# Altium schematic sheet FEU31_Part3.SchDoc: Интерфейсный модуль ФЭУ-31
size A3; Address1: (с) Быканов Андрей; Address2: г.Тула 2016г.; Revision: 1.3
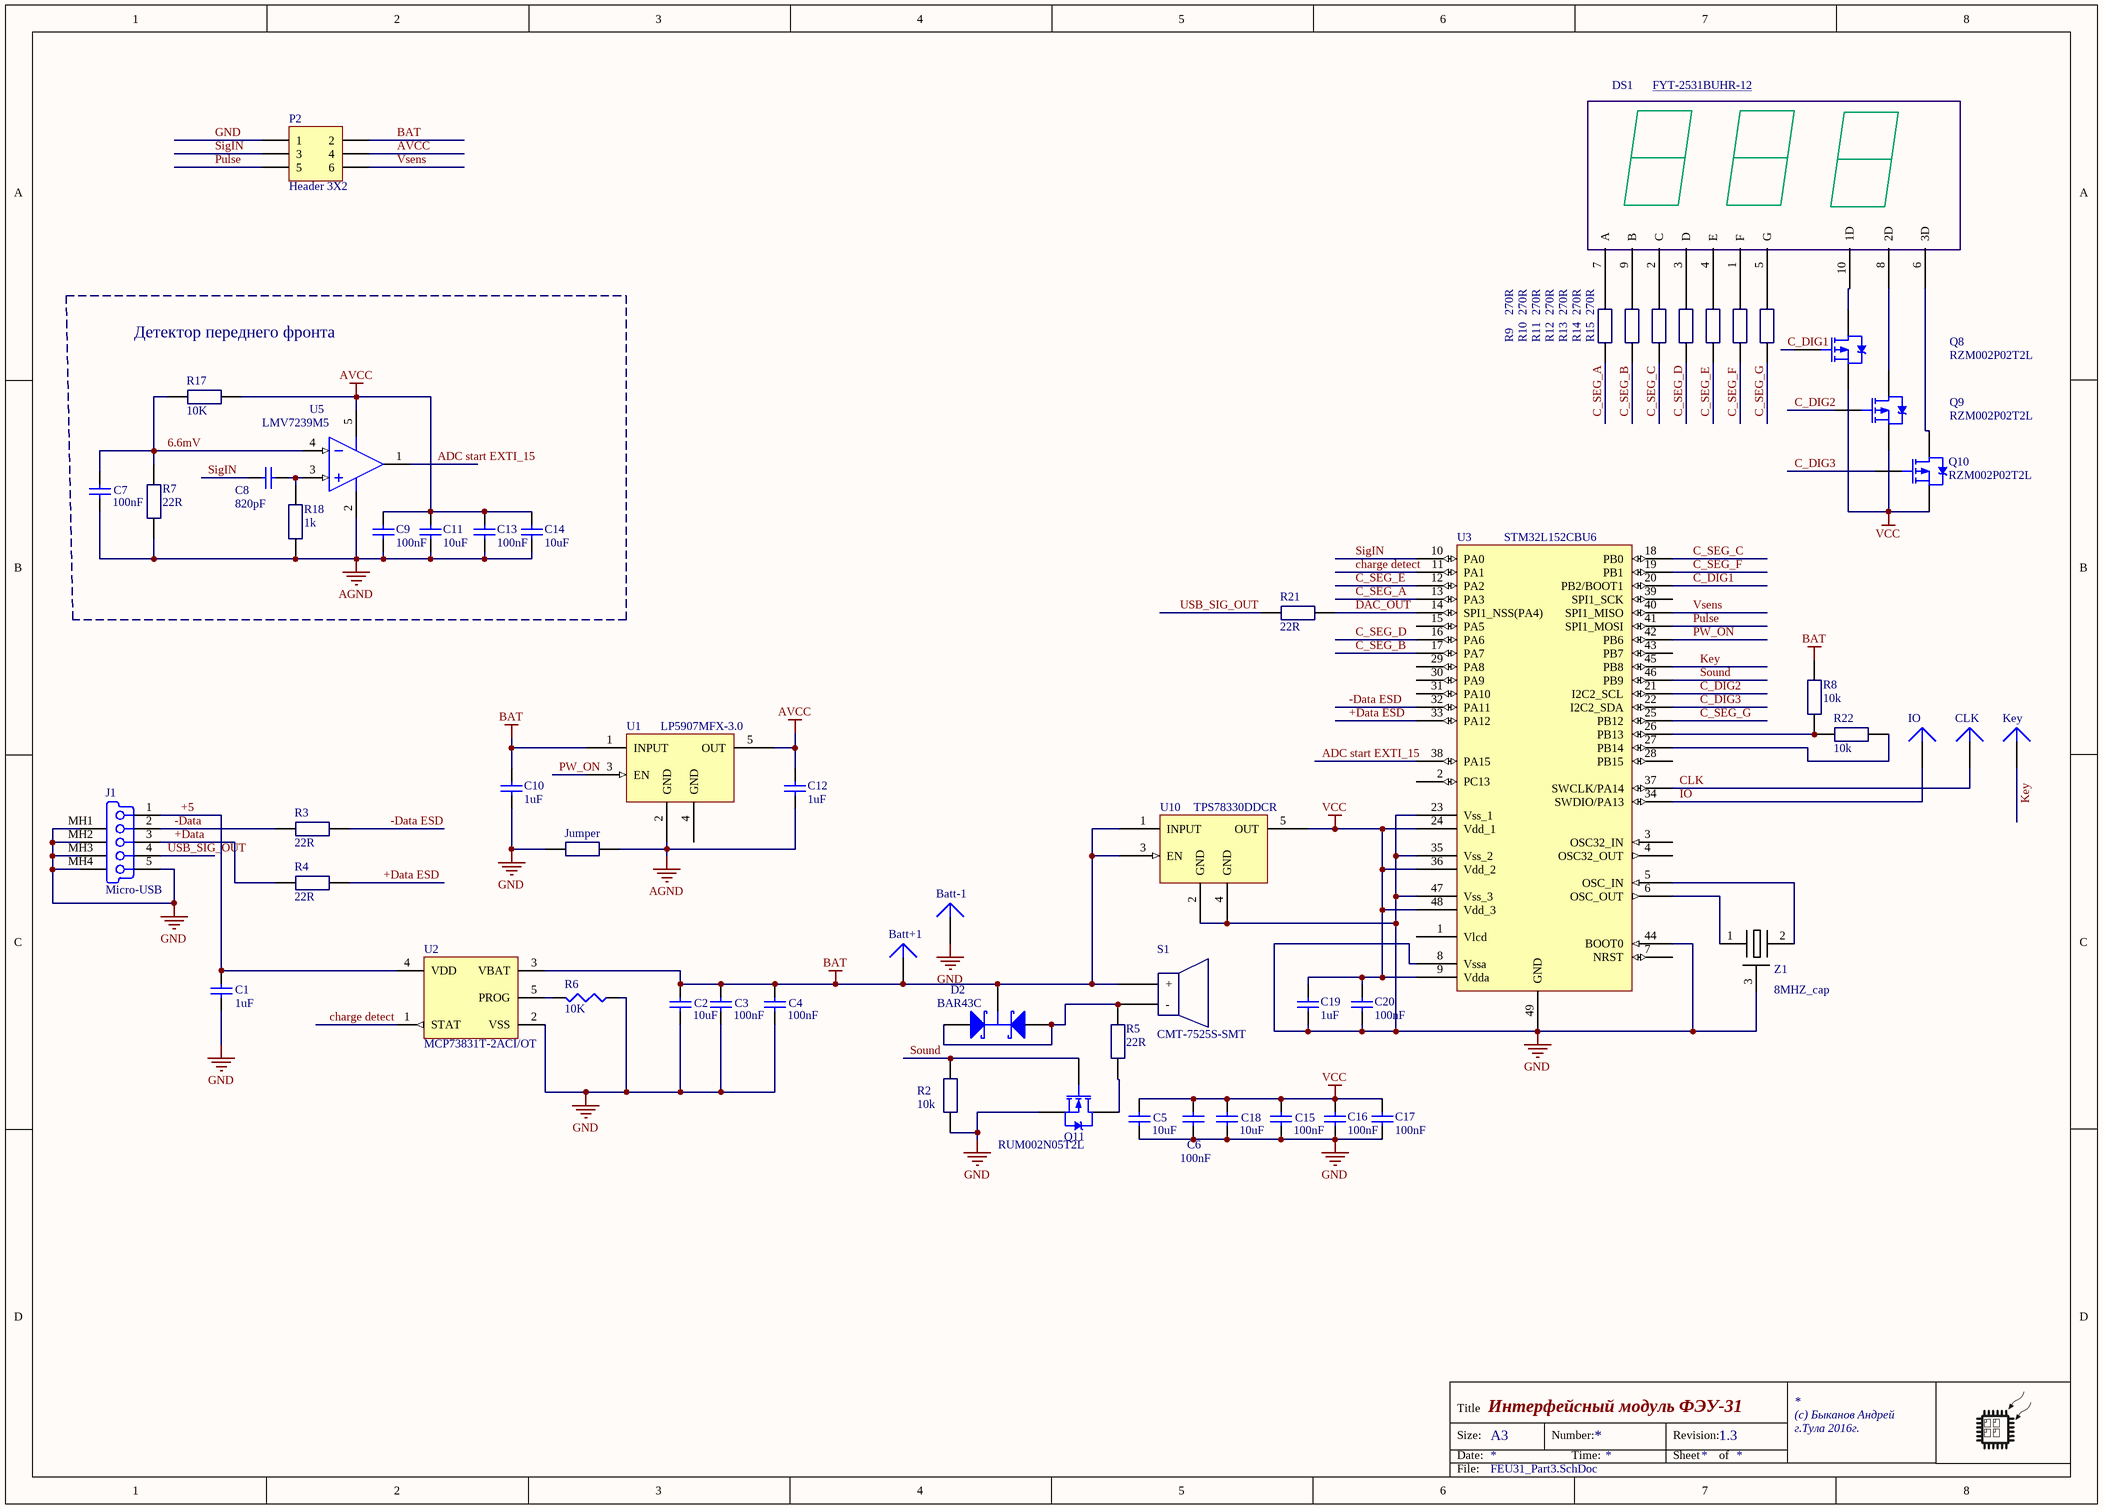
[diagram p0: FEU31_Part3.SchDoc]

## Parts
Batt+1  (no value)  [Sensor contact]  (no BOM)
Batt-1  (no value)  [Sensor contact]  (no BOM)
C1  1uF  [0402 AVX]
C2  10uF  [1608[0603]]
C3  100nF  [0402 AVX]
C4  100nF  [0402 AVX]
C5  10uF  [1608[0603]]
C6  100nF  [0402 AVX]
C7  100nF  [0402 AVX]
C8  820pF  [1608[0603]]
C9  100nF  [0402 AVX]
C10  1uF  [0402 AVX]
C11  10uF  [1608[0603]]
C12  1uF  [0402 AVX]
C13  100nF  [0402 AVX]
C14  10uF  [1608[0603]]
C15  100nF  [0402 AVX]
C16  100nF  [0402 AVX]
C17  100nF  [0402 AVX]
C18  10uF  [1608[0603]]
C19  1uF  [0402 AVX]
C20  100nF  [0402 AVX]
CLK  (no value)  [Sensor contact]  (no BOM)
D2  BAR43C  [SOT23-3]
DS1  FYT-2531BUHR-12  [FYT-2531BUHR-12]
IO  (no value)  [Sensor contact]  (no BOM)
J1  Micro-USB  [47346-0001]
Jumper  (no value)  [0402 jumper]  (net tie, no BOM)
Key  (no value)  [Sensor contact]  (no BOM)
P2  Header 3X2  [PLS_FLAT_CONN_6]  (no BOM)
Q8  RZM002P02T2L  [RUM002N05]
Q9  RZM002P02T2L  [RUM002N05]
Q10  RZM002P02T2L  [RUM002N05]
Q11  RUM002N05T2L  [RUM002N05]
R2  10k  [1608[0603]]
R3  22R  [1608[0603]]
R4  22R  [1608[0603]]
R5  22R  [1608[0603]]
R6  10K  [J1-0603]
R7  22R  [1608[0603]]
R8  10k  [1608[0603]]
R9  270R  [1608[0603]]
R10  270R  [1608[0603]]
R11  270R  [1608[0603]]
R12  270R  [1608[0603]]
R13  270R  [1608[0603]]
R14  270R  [1608[0603]]
R15  270R  [1608[0603]]
R17  10K  [1608[0603]]
R18  1k  [1608[0603]]
R21  22R  [1608[0603]_RES]
R22  10k  [1608[0603]]
S1  CMT-7525S-SMT  [CMT-7525S-SMT]
U1  LP5907MFX-3.0  [TPS78330DDCR]
U2  MCP73831T-2ACI/OT  [SOT-23-OT5_N]
U3  STM32L152CBU6  [UFQFPN48]
U5  LMV7239M5  [MF05A_N]
U10  TPS78330DDCR  [TPS78330DDCR]
Z1  8MHZ_cap  [PRQV8.00CR5010Y000]

## Blocks framed on the sheet
Детектор переднего фронта: C7-C9 C11 C13 C14 R7 R17 R18 U5

## Nets
AGND: C7.2 C9.2 C11.2 C12.2 C13.2 C14.2 Jumper.1(A) R7.1(A) R18.2 U1.2(GND) U5.2(V-)
AVCC: C9.1 C11.1 C12.1 C13.1 C14.1 P2.4 R17.2 U1.5(OUT) U5.5(V+)
BAT: Batt+1.1 C2.1 C3.1 C4.1 C10.1 D2.3(K) P2.2 R8.1(A) S1.+ U1.1(INPUT) U2.3(VBAT) U10.1(INPUT) U10.3(EN)
GND: Batt-1.1 C1.1 C2.2 C3.2 C4.2 C5.2 C6.2 C10.2 C15.2 C16.2 C17.2 C18.2 C19.2 C20.2 J1.5(GND) J1.MH1(Tab) J1.MH2(Tab) J1.MH3(Tab) J1.MH4(Tab) Jumper.2 P2.1 Q11.2(S) R2.2 R6.1 U2.2(VSS) U3.8(Vssa) U3.23(Vss_1) U3.35(Vss_2) U3.44(BOOT0) U3.47(Vss_3) U3.49(GND) U10.2(GND) U10.4(GND) Z1.3
VCC: C5.1 C6.1 C15.1 C16.1 C17.1 C18.1 C19.1 C20.1 Q8.2(S) Q9.2(S) Q10.2(S) U3.9(Vdda) U3.24(Vdd_1) U3.36(Vdd_2) U3.48(Vdd_3) U10.5(OUT)
6.6mV: C7.1 R7.2 R17.1(A) U5.4(IN-)
+5: C1.2 J1.1(V_BUS_(5V)) U2.4(VDD)
+Data: J1.3(D+) R4.2
+Data ESD: R4.1(A) U3.33(PA12)
-Data: J1.2(D-) R3.2
-Data ESD: R3.1(A) U3.32(PA11)
ADC start EXTI_15: U3.38(PA15) U5.1(VOUT)
C_DIG1: Q8.1(G) U3.20(PB2/BOOT1)
C_DIG2: Q9.1(G) U3.21(I2C2_SCL)
C_DIG3: Q10.1(G) U3.22(I2C2_SDA)
C_SEG_A: R12.2 U3.13(PA3)
C_SEG_B: R13.2 U3.17(PA7)
C_SEG_C: R11.2 U3.18(PB0)
C_SEG_D: R14.2 U3.16(PA6)
C_SEG_E: R10.2 U3.12(PA2)
C_SEG_F: R15.2 U3.19(PB1)
C_SEG_G: R9.2 U3.25(PB12)
charge detect: U2.1(STAT) U3.11(PA1)
CLK: CLK.1 U3.37(SWCLK/PA14)
DAC_OUT: R21.1(A) U3.14(SPI1_NSS(PA4))
IO: IO.1 U3.34(SWDIO/PA13)
Key: Key.1 U3.45(PB8)
Pulse: P2.5 U3.41(SPI1_MOSI)
PW_ON: U1.3(EN) U3.42(PB6)
SigIN: C8.2 P2.3 U3.10(PA0)
Sound: Q11.1(G) R2.1(A) U3.46(PB9)
USB_SIG_OUT: J1.4(NC) R21.2
Vsens: P2.6 U3.40(SPI1_MISO)
NetC8_1: C8.1 R18.1(A) U5.3(IN+)
NetD2_1: D2.1(A1) D2.2(A2) R5.1(A) S1.-
NetDS1_1: DS1.1(F) R15.1(A)
NetDS1_2: DS1.2(C) R11.1(A)
NetDS1_3: DS1.3(D) R14.1(A)
NetDS1_4: DS1.4(E) R10.1(A)
NetDS1_5: DS1.5(G) R9.1(A)
NetDS1_6: DS1.6(3D) Q10.3(D)
NetDS1_7: DS1.7(A) R12.1(A)
NetDS1_8: DS1.8(2D) Q9.3(D)
NetDS1_9: DS1.9(B) R13.1(A)
NetDS1_10: DS1.10(1D) Q8.3(D)
NetQ11_3: Q11.3(D) R5.2
NetR6_2: R6.2 U2.5(PROG)
NetR8_2: R8.2 R22.2 U3.26(PB13)
NetR22_1: R22.1(A) U3.27(PB14)
NetU3_5: U3.5(OSC_IN) Z1.2
NetU3_6: U3.6(OSC_OUT) Z1.1

Not connected (* = marked no-connect by the designer): U1 4(GND); U3 1(Vlcd) 2(PC13) 3(OSC32_IN) 4(OSC32_OUT) 7(NRST) 15(PA5) 28(PB15) 29(PA8) 30(PA9) 31(PA10) 39(SPI1_SCK) 43(PB7)

## Notes on the sheet
- Title
- Size:
- Date:
- A3
- Number:
- Time:
- Revision:
- Sheet
- of
- File:

## Library data of the parts
Batt+1 Batt-1 CLK IO Key = Plug: LatestRevisionDate: 17-Jul-2002; LatestRevisionNote: Re-released for DXP Platform.; Publisher: Altium Limited
C1 = Cap Semi: Capacitor (Semiconductor SIM Model); Order: CC0402KRX5R5BB105; Avail: 1; Published: 8-Jun-2000; LatestRevisionDate: 29-May-2009; LatestRevisionNote: IPC-7351 Footprint Added.; PackageReference: C1206; Publisher: Altium Limited; PackageDescription: Chip Capacitor; Value: 1uF
C2 C5 C11 C14 C18 = Cap Semi: Capacitor (Semiconductor SIM Model); Order: GRM188R60J106ME47D; Published: 8-Jun-2000; LatestRevisionDate: 29-May-2009; LatestRevisionNote: IPC-7351 Footprint Added.; PackageReference: C1206; Publisher: Altium Limited; PackageDescription: Chip Capacitor; Value: 10uF
C3 C4 C6 C7 C9 C13 C15-C17 C20 = Cap Semi: Capacitor (Semiconductor SIM Model); Order: 0402ZD104KAT2A; Published: 8-Jun-2000; LatestRevisionDate: 29-May-2009; LatestRevisionNote: IPC-7351 Footprint Added.; PackageReference: C1206; Publisher: Altium Limited; PackageDescription: Chip Capacitor; Value: 100nF
C8 = Cap Semi: Capacitor (Semiconductor SIM Model); Order: CC0603JRNPO9BN821; Published: 8-Jun-2000; LatestRevisionDate: 29-May-2009; LatestRevisionNote: IPC-7351 Footprint Added.; PackageReference: C1206; Publisher: Altium Limited; PackageDescription: Chip Capacitor; Value: 820pF
C10 C12 C19 = Cap Semi: Capacitor (Semiconductor SIM Model); Order: CC0402KRX5R5BB105; Published: 8-Jun-2000; LatestRevisionDate: 29-May-2009; LatestRevisionNote: IPC-7351 Footprint Added.; PackageReference: C1206; Publisher: Altium Limited; PackageDescription: Chip Capacitor; Value: 1uF
D2 = BAT54C: Schottky Barrier Double Diode; Published: 17-Sep-2003; LatestRevisionDate: 12-Dec-2006; LatestRevisionNote: IPC-7351 Footprint Added.; DatasheetVersion: 4-Mar-2002; PackageVersion: May-1999; PackageReference: SOT23; Publisher: Altium Limited; PackageDescription: 3-Pin SOT-23 Package 0.95 mm Pitch, 2.3 mm Lead Span; ComponentLink1Description: Manufacturer Link; ComponentLink1URL: http://www.semiconductors.philips.com/; ComponentLink2Description: Datasheet; ComponentLink2URL: http://www.semiconductors.philips.com/acrobat/datasheets/BAT54_SERIES_4.pdf; Order: BAR43C
DS1 = FYT-2531BUHR-12_1: 7-segment 3x indicator; Datasheet: http://www.rct.ru/pdf/indicator/fyq-5643ax_bx.pdf; Order: FYT-2531BUHR-12
J1 = 0481900001: USB On-The-Go (OTG) Mini-B Receptacle, Right Angle, SMT, 0.80mm (.031") Pitch, Solder Tabs with Back Cover, Recessed Type; Order: Molex 47346-0001
Jumper = Resistor 0805: Avail: 1
P2 = Header 3X2: Header, 3-Pin, Dual row; LatestRevisionDate: 17-Jul-2002; LatestRevisionNote: Re-released for DXP Platform.; Publisher: Altium Limited
Q8-Q10 = IRLML6401: HEXFET Power MOSFET; Published: 17-Sep-2003; DatasheetVersion: 2-Jul-2001; PackageVersion: Jul-2001; PackageReference: Micro3; Publisher: Altium Limited; PackageDescription: 3-Pin SOT-23 Package 0.95 mm Pitch, 2.3 mm Lead Span; ComponentLink1Description: Manufacturer Link; ComponentLink1URL: http://www.irf.com/; ComponentLink2Description: Datasheet; ComponentLink2URL: http://www.irf.com/product-info/datasheets/data/IRLML6401.pdf; Order: RZM002P02T2L
Q11 = IRLML2402: HEXFET Power MOSFET; Published: 8-Jun-2000; LatestRevisionDate: 20-Nov-2009; LatestRevisionNote: IPC-7351 Footprint Added.; DatasheetVersion: Aug-1997; PackageReference: SOT-23; Publisher: Altium Limited; PackageDescription: 3-Pin SOT-23 Package 0.95 mm Pitch, 2.3 mm Lead Span; ComponentLink1Description: Manufacturer Link; ComponentLink1URL: http://www.irf.com/; ComponentLink2Description: Datasheet; ComponentLink2URL: http://www.irf.com/product-info/datasheets/data/irlml2402.pdf; Order: RUM002N05T2L; Value: RUM002N05T2L
R2 R8 R17 R22 = Resistor 0805: Order: RC0603FR-1010KL; Avail: 1
  R2 R8 R22: Value: 10k
  R17: Value: 10K
R3-R5 = Resistor 0805: Order: RC0603JR-122RL; Avail: 20; Value: 22R
R6 = Res3: Resistor; Order: RC0603FR-1010KL; Avail: 1; Published: 8-Jun-2000; LatestRevisionDate: 29-May-2009; LatestRevisionNote: IPC-7351 Footprint Added.; PackageReference: J1-0603; Publisher: Altium Limited; PackageDescription: Chip Resistor; Value: 10K
R7 = Resistor 0805: Order: RC0603JR-122RL; Avail: 1; Value: 22R
R9-R15 = Resistor 0805: Order: RC0603JR-07270RL; Avail: 1; Value: 270R
R18 = Resistor 0805: Order: RC0603FR-101KL; Avail: 1; Value: 1k
R21 = Resistor 0805: Order: RC0603JR-122RL; Value: 22R
U1 = TPS78330DDCR: Order: LP5907MFX-3.0
U2 = MCP73831T-2ACI/OT: Miniature Single-Cell, Fully Integrated Li-Ion, Li-Polymer Charge Management Controller, 4.2V, 5-Pin SOT-23, Industrial Temperature, Tape and Reel; Avail: 1; Published: 29-Jan-2009; LatestRevisionDate: 27-Nov-2009; LatestRevisionNote: Updated to datasheet revision E, Sep-2008; DatasheetVersion: revE, Sep-2008; PackageVersion: revBB, Aug-2009; PackageReference: SOT-23-OT5; Publisher: Altium Limited; PackageDescription: 5-Lead Plastic Small Outline Transistor (OT) [SOT-23]; Supplier 1: Digi-Key; Supplier Part Number 1: MCP73831T-2ACI/OTTR-ND; Supplier 2: Digi-Key; Supplier Part Number 2: MCP73831T-2ACI/OTCT-ND; Supplier 3: Digi-Key; Supplier Part Number 3: MCP73831T-2ACI/OTDKR-ND; Supplier 4: Farnell; Supplier Part Number 4: 1332158; Code_IPC: SOT23-5; ComponentLink1Description: Datasheet; ComponentLink1URL: http://ww1.microchip.com/downloads/en/DeviceDoc/21984e.pdf; ComponentLink2Description: Packaging Specification; ComponentLink2URL: http://www.microchip.com/stellent/groups/techpub_sg/documents/packagingspec/en012702.pdf; ComponentLink3Description: Microchip.com Home; ComponentLink3URL: http://www.microchip.com/; Order: MCP73831T-2ACI/OT
U5 = LMV7239M5: 45 nsec, Ultra Low Power, Low Voltage, Rail-to-Rail Input Comparator with Open-Drain/Push-Pull Output, 5-pin SOT-23; Manufacturer: National Semiconductor; PackageTopMarking: C20A*XTT; PowerWise: Y; CompType: Amplifiers; Published: 4-Dec-2008; DatasheetVersion: Jul-2008; PackageVersion: revD, Aug-2008; PackageReference: MF05A; Publisher: Altium Limited; PackageDescription: Molded SOT-23, .115 x .063 x .040 in Body, 5 Lead, .0375 in Pitch; Supplier 1: Farnell; Supplier Part Number 1: 9778926RL; Supplier 2: Farnell; Supplier Part Number 2: 9778926; PartNumber: LMV7239M5; RoHS: N; PinCount: 5; ComponentLink1Description: LMV7239 Datasheet; ComponentLink1URL: http://www.national.com/ds/LM/LMV7239.pdf; ComponentLink2Description: LMV7239 Web Page; ComponentLink2URL: http://www.national.com/pf/LM/LMV7239.html; ComponentLink3Description: MF05A Package Page; ComponentLink3URL: http://www.national.com/packaging/folders/mf05a.html; Order: LMV7239M5
Z1 = 8MHZ_cap: Order: CSTCE8M00G55-R0
S1 = CMT-7525S-SMT: Order: CMT-7525S-SMT
U3 = STM32L152CBU6: Order: STM32L152CBU6
U10 = TPS78330DDCR: Order: TPS78330DDCR